# Altium schematic sheet NB3000_MIDI.SchDoc
size A; DocumentNumber: 1; SheetNumber: 1; SheetTotal: 1
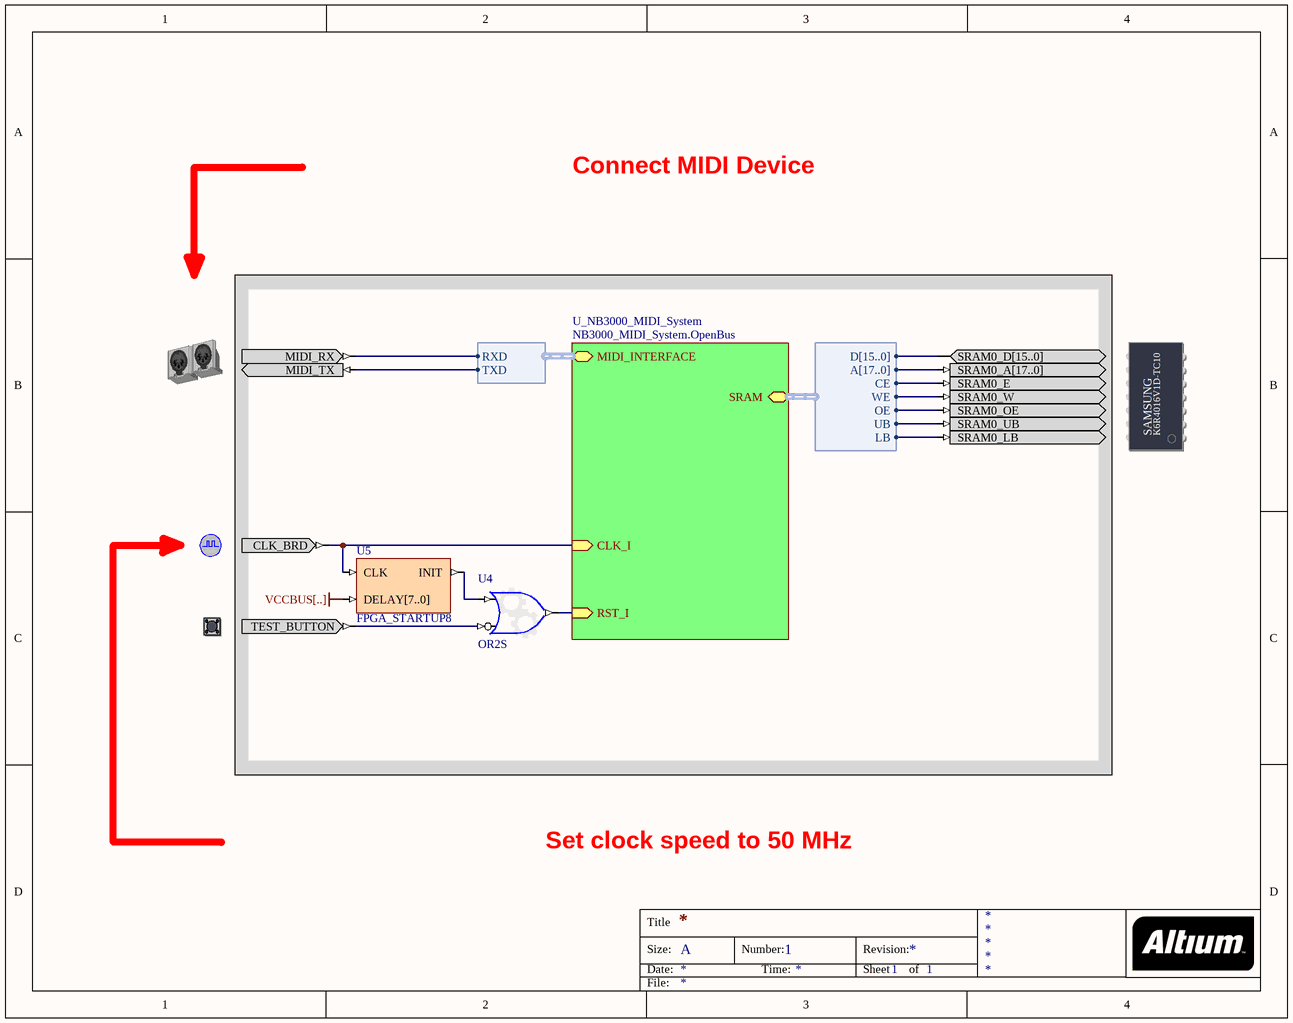
[diagram p0: NB3000_MIDI.SchDoc]

## Parts
(Parts that share a designator on the sheet are numbered #1, #2 ... from top to bottom, then left to right.)
?#1  MIDI  (value not drawn)
?#2  SRAM0  (value not drawn)
?#3  CLOCK_BOARD  (value not drawn)
?#4  TEST_BUTTON  (value not drawn)
U4  OR2S
U5  FPGA_STARTUP8

## Sub-sheets
U_NB3000_MIDI_System = NB3000_MIDI_System.OpenBus: CLK_I (in), RST_I (in), SRAM (harness WB_MEM_CTRL_SRAM16_A18), MIDI_INTERFACE (harness WB_MIDI)

## Harnesses
WB_MIDI: RXD, TXD
WB_MEM_CTRL_SRAM16_A18: D[15..0], A[17..0], CE, WE, OE, UB, LB

## Nets
VCCBUS[..]: U5.DELAY[7..0]
Net?#1_MIDI_RX: ?#1.MIDI_RX ; sheet U_NB3000_MIDI_System/MIDI_INTERFACE.RXD
Net?#1_MIDI_TX: ?#1.MIDI_TX ; sheet U_NB3000_MIDI_System/MIDI_INTERFACE.TXD
Net?#2_SRAM0_A[17..0]: ?#2.SRAM0_A[17..0] ; sheet U_NB3000_MIDI_System/SRAM.A[17..0]
Net?#2_SRAM0_D[15..0]: ?#2.SRAM0_D[15..0] ; sheet U_NB3000_MIDI_System/SRAM.D[15..0]
Net?#2_SRAM0_E: ?#2.SRAM0_E ; sheet U_NB3000_MIDI_System/SRAM.CE
Net?#2_SRAM0_LB: ?#2.SRAM0_LB ; sheet U_NB3000_MIDI_System/SRAM.LB
Net?#2_SRAM0_OE: ?#2.SRAM0_OE ; sheet U_NB3000_MIDI_System/SRAM.OE
Net?#2_SRAM0_UB: ?#2.SRAM0_UB ; sheet U_NB3000_MIDI_System/SRAM.UB
Net?#2_SRAM0_W: ?#2.SRAM0_W ; sheet U_NB3000_MIDI_System/SRAM.WE
Net?#3_CLK_BRD: ?#3.CLK_BRD U5.CLK ; sheet U_NB3000_MIDI_System/CLK_I
Net?#4_TEST_BUTTON: ?#4.TEST_BUTTON U4.I1
NetU4_I0: U4.I0 U5.INIT
NetU4_O: U4.O ; sheet U_NB3000_MIDI_System/RST_I

## Notes on the sheet
- Connect MIDI Device
- Set clock speed to 50 MHz
- Title
- Size:
- Date:
- A
- Number:
- Time:
- Revision:
- Sheet
- of
- File:
- (in symbol SRAM0) SAMSUNG; K6R4016V1D-TC10

## Library data of the parts
?#1 = MIDI: MIDI Connector; PortComponent: True; Published: 16-Mar-2009; Publisher: Altium Limited
?#2 = SRAM0: Free Static RAM - Daughterboard; PortComponent: True; Published: 14-May-2007; Publisher: Altium Limited; HelpURL: TR0149 Technical Reference for Altium's Xilinx Spartan-3 Daughter Board DB30.pdf#page=16
?#3 = CLOCK_BOARD: Global System Clock Supply; PortComponent: True; Published: 19-Nov-2003; Publisher: Altium Limited; HelpURL: https://wiki.altium.com/display/ADOH/NanoBoard+3000+-+System+Clocks; UseInDSF: True
?#4 = TEST_BUTTON: Test / Reset Button; PortComponent: True; Published: 19-Nov-2003; Publisher: Altium Limited; HelpURL: https://wiki.altium.com/display/ADOH/NanoBoard+3000+-+Test-Reset+Button
U4 = GATE: Configurable Generic Gate; ConfiguratorName: GENERIC_GATE; ConfigurationParameters: {}Version[1.0]{}GateKind[OR]{}BusInput[False]{}GateInputType[Bit]{}GateOutputOption[Normal]{}BusWidth[8]{}RegisterOutputs[False]{}NegativeClockEdge[False]{}InputCount[2]{}InputInvert0[False]{}InputInvert1[True]{}; LastRevisionNo: 1.00.00; Published: 3-Sep-2008; Publisher: Altium Limited
U5 = FPGA_STARTUP8: FPGA Startup With 8 Bit Delay; Published: 9-Dec-2004; Publisher: Altium Limited; HelpURL: CR0119 FPGA_STARTUPx Powerup Delay Unit.pdf; LastRevisionNo: 1.00.00; ComponentLink1Description: Core &Resource Usage; ComponentLink1URL: CR0139 FPGA Peripheral Resource Usage.pdf#page=11